# Altium schematic sheet REUN.468349.001_PSU_Board_Button.SchDoc
size 420 x 297 mm; DocumentNumber: РЕУН.468349.001 Э3 2D; SheetNumber: 4; Format: A3
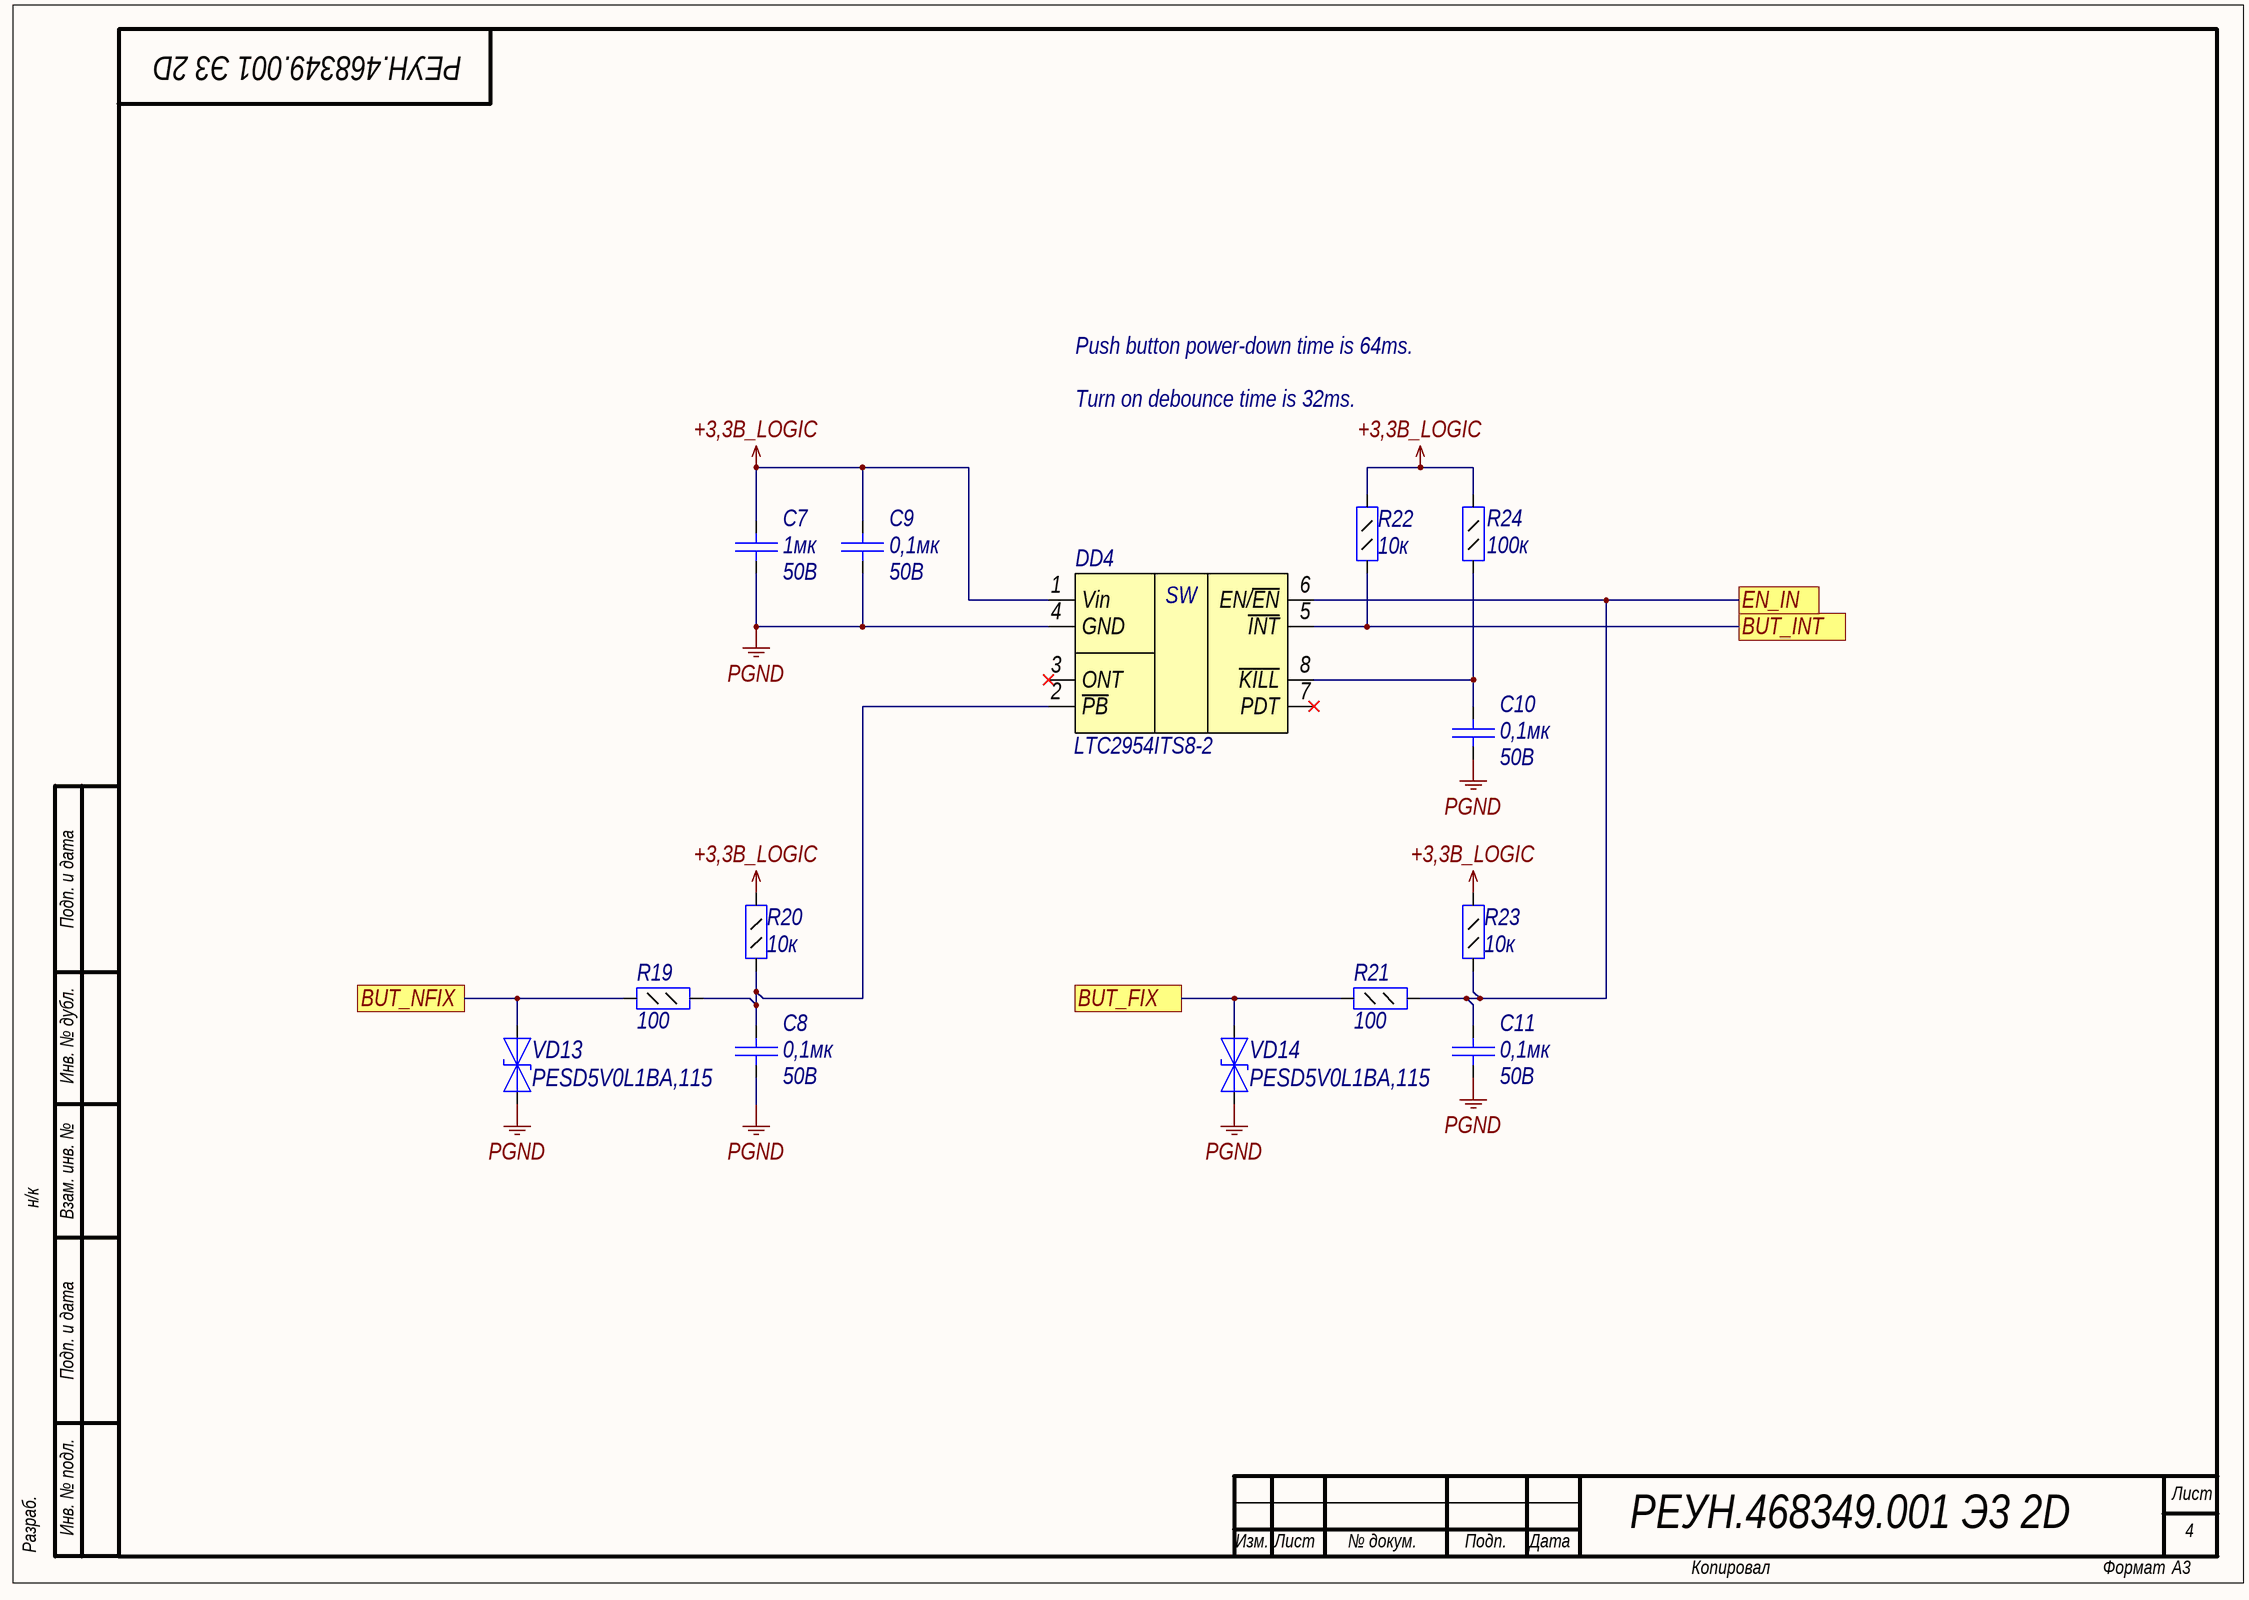
[diagram p0: REUN.468349.001_PSU_Board_Button.SchDoc]

## Parts
C7  Voltage: 50B  [C0805]  (hidden comment: 1мк)
C8  Voltage: 50B  [C0805]  (hidden comment: 0,1мк)
C9  Voltage: 50B  [C0805]  (hidden comment: 0,1мк)
C10  Voltage: 50B  [C0805]  (hidden comment: 0,1мк)
C11  Voltage: 50B  [C0805]  (hidden comment: 0,1мк)
DD4  LTC2954ITS8-2  [SOT-23-8]
R19  value 100  [R0805]  (hidden comment: Resistor_0,125Вт)
R20  value 10к  [R0805]  (hidden comment: Resistor_0,125Вт)
R21  value 100  [R0805]  (hidden comment: Resistor_0,125Вт)
R22  value 10к  [R0805]  (hidden comment: Resistor_0,125Вт)
R23  value 10к  [R0805]  (hidden comment: Resistor_0,125Вт)
R24  value 100к  [R0805]  (hidden comment: Resistor_0,125Вт)
VD13  PESD5V0L1BA,115  [SOD-323]
VD14  PESD5V0L1BA,115  [SOD-323]

## Ports
BUT_FIX, BUT_INT, BUT_NFIX, EN_IN

## Nets
+3,3B_LOGIC: C7.2 C9.2 DD4.1(Vin) R20.2 R22.2 R23.2 R24.2
PGND: C7.1 C8.1 C9.1 C10.1 C11.1 DD4.4(GND) VD13.2(A) VD14.2(A)
BUT_FIX: R21.1 VD14.1(K) ; port BUT_FIX
BUT_INT: DD4.5(~{INT}) R22.1 ; port BUT_INT
BUT_NFIX: R19.1 VD13.1(K) ; port BUT_NFIX
EN_IN: C11.2 DD4.6(EN/~{EN}) R21.2 R23.1 ; port EN_IN
NetC8_2: C8.2 DD4.2(~{PB}) R19.2 R20.1
NetC10_2: C10.2 DD4.8(~{KILL}) R24.1

Not connected (* = marked no-connect by the designer): DD4 3(ONT)* 7(PDT)*

## Notes on the sheet
- Push button power-down time is 64ms.
- Turn on debounce time is 32ms.
- Подп. и дата
- Инв. № дубл.
- н/к
- Взам. инв. №
- Разраб.
- Инв. № подл.
- Лист
- Изм.
- № докум.
- Подп.
- Дата
- Копировал
- Формат
- (in symbol btn11) SW

## Library data of the parts
C7 = cap151: Конденсатор; Part Name: Ceramic; Manufacture: Murata; Part Number: GRM21BR71H105KA12L; id: cap151; TKE: X7R; Value: 1мк
C8-C11 = cap141: Конденсатор; Part Name: Ceramic; Manufacture: Murata; Part Number: GRM21BR71H104KA01K; id: cap141; TKE: X7R; Value: 0,1мк
DD4 = btn11: Pushbutton On/Off Controller with µP Interrupt; Manufacture: Analog Devices; id: btn11; Part Name: Pushbutton On/Off Controller; Part Number: LTC2954ITS8-2
R19 = res49: Резистор; Manufacture: Yageo; Part Number: RC0805FR-07100RL; Accuracy: 0.01; id: res49; Part Name: Resistor; Power: 0,125Вт
R20 R22 R23 = res101: Резистор; Manufacture: Yageo; Part Number: RC0805FR-0710KL; id: res101; Accuracy: 0.01; Part Name: Resistor; Power: 0,125Вт
R21 = res49: Резистор; Manufacture: Yageo; Part Number: RC0805FR-07100RL; id: res49; Accuracy: 0.01; Part Name: Resistor; Power: 0,125Вт
R24 = res125: Резистор; Manufacture: Yageo; Part Number: RC0805FR-07100KL; id: res125; Accuracy: 0.01; Part Name: Resistor; Power: 0,125Вт
VD13 VD14 = PESD5V0L1BA,115: Cтабилитрон (диод выпрямительный лавинный) двусторонний; Part Name: TVS diode Bidirectional; Manufacture: Nexperia; id: tvs286; Leakage Current: 1uA; Stand-off Voltage: 5B; Breakdown Voltage: 8,2B; Clamping voltage: 10B; Peak Pulse Power: 500W; Number of diodes: 1; Part Number: PESD5V0L1BA,115